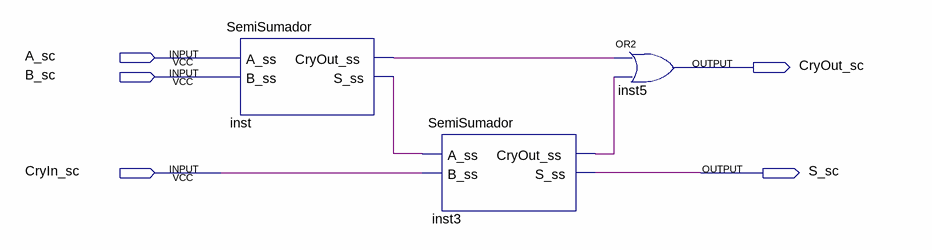
[diagram p0: schematic sheet]
// Quartus schematic SumadorCompleto.bdf as structural Verilog: 3 symbols, 5 pins
module SumadorCompleto (
  input  A_sc,
  input  B_sc,
  input  CryIn_sc,
  output CryOut_sc,
  output S_sc
);

  wire inst3_cryout_ss, inst_cryout_ss, inst_s_ss;

  SemiSumador inst (.A_ss(A_sc), .B_ss(B_sc), .CryOut_ss(inst_cryout_ss), .S_ss(inst_s_ss));
  SemiSumador inst3 (.A_ss(inst_s_ss), .B_ss(CryIn_sc), .CryOut_ss(inst3_cryout_ss), .S_ss(S_sc));
  or inst5 (CryOut_sc, inst_cryout_ss, inst3_cryout_ss);
endmodule
